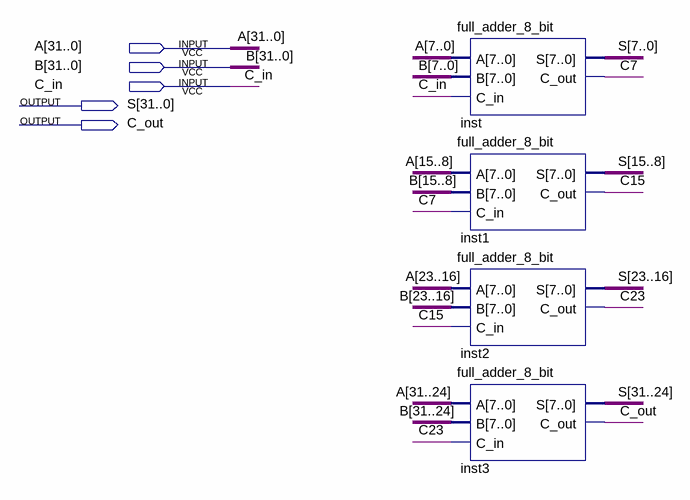
[diagram p0: schematic sheet]
// Quartus schematic full_adder_32_bit.bdf as structural Verilog: 4 symbols, 5 pins
module full_adder_32_bit (
  input  [31:0] A,
  input  [31:0] B,
  input  C_in,
  output [31:0] S,
  output C_out
);

  wire C7, C15, C23;

  full_adder_8_bit inst (.A(A[7:0]), .B(B[7:0]), .C_in(C_in), .S(S[7:0]), .C_out(C7));
  full_adder_8_bit inst1 (.A(A[15:8]), .B(B[15:8]), .C_in(C7), .S(S[15:8]), .C_out(C15));
  full_adder_8_bit inst2 (.A(A[23:16]), .B(B[23:16]), .C_in(C15), .S(S[23:16]), .C_out(C23));
  full_adder_8_bit inst3 (.A(A[31:24]), .B(B[31:24]), .C_in(C23), .S(S[31:24]), .C_out(C_out));
endmodule
